# EAGLE design 5v-buck-regulator (EAGLE 6.4)
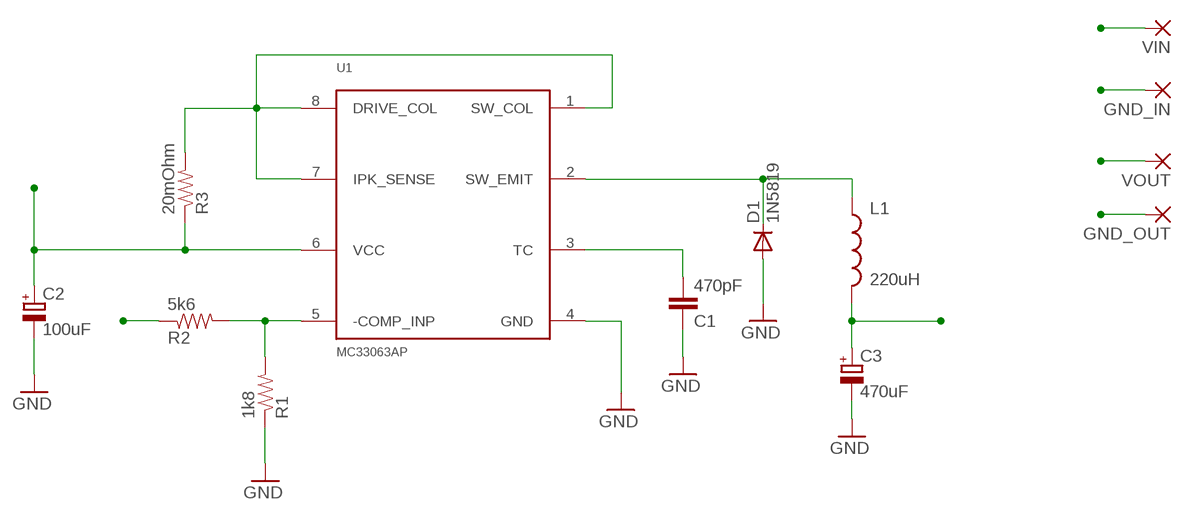
[diagram p0: schematic, sheet 1]

## Parts
C1  470pF  CAP0805  [0805]
C2  100uF  CPOL-EUC  [PANASONIC_C]
C3  470uF  CPOL-EUD  [PANASONIC_D]
D1  1N5819  MBR0520LT  [SOD123]
GND_IN  WIREPAD2,54/0,8  [2,54/0,8]
GND_OUT  WIREPAD2,54/0,8  [2,54/0,8]
L1  220uH  INDUCTOR-B82462G  [B82462G]
R1  1k8  RESISTOR0805-RES  [0805]
R2  5k6  RESISTOR0805-RES  [0805]
R3  20mOhm  RESISTOR2010  [R2010]
U1  MC33063AP  MC33063AMC34063A  [SOIC-8]
VIN  WIREPAD2,54/0,8  [2,54/0,8]
VOUT  WIREPAD2,54/0,8  [2,54/0,8]

## Nets
GND: C1.1 C2.- C3.- D1.A GND_IN.1(P) GND_OUT.1(P) R1.1 U1.4(GND)
N$2: C1.2 U1.3(TC)
N$3: R3.2 U1.1(SW_COL) U1.7(IPK_SENSE) U1.8(DRIVE_COL)
N$32: D1.C L1.P$1 U1.2(SW_EMIT)
N$55: R1.2 R2.2 U1.5(-COMP_INP)
VIN: C2.+ R3.1 U1.6(VCC) VIN.1(P)
VOUT: C3.+ L1.P$2 R2.1 VOUT.1(P)

## Library data of the parts
C1 = SparkFun:CAP: Capacitor Standard 0603 ceramic capacitor, and 0.1" leaded capacitor.
C2 C3 = rcl:CPOL-EU: POLARIZED CAPACITOR, European symbol
D1 = diode:MBR0520LT: SCHOTTKY BARRIER RECTIFIER Source: http://onsemi.com .. MBR0520LT1-D.pdf
GND_IN GND_OUT VIN VOUT = wirepad:WIREPAD: Wire PAD connect wire on PCB
L1 = SparkFun:INDUCTOR: Inductors Basic Inductor/Choke - 0603 and 1206. Footprints are not proven and vary greatly between part numbers.
R1-R3 = SparkFun:RESISTOR: Resistor Basic schematic elements and footprints for 0603, 1206, and PTH resistors.
U1 = Synapseware:MC33063A

## Board
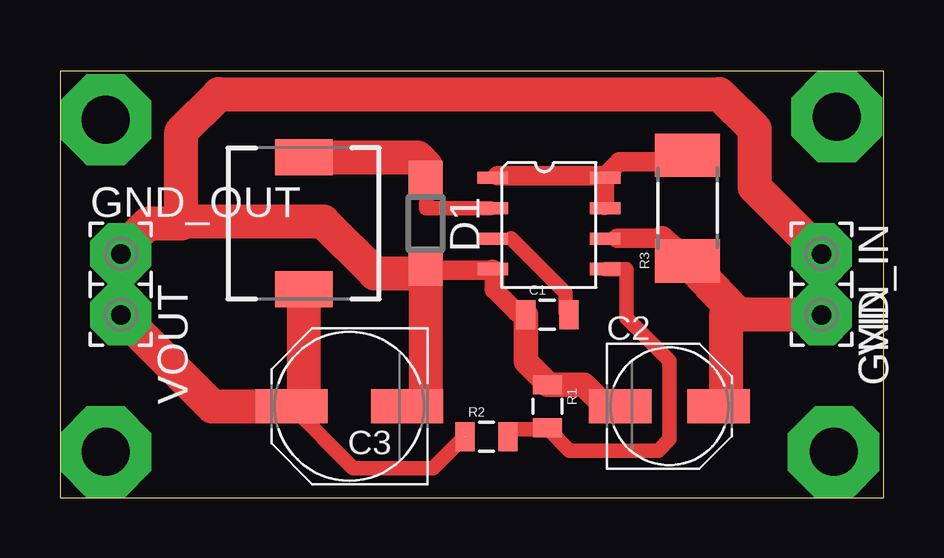
[diagram p1: board, top side]

Size 34.34 x 17.77 mm. Coordinates in mm from the lower left corner, seen from the top.
Outline: 0,0 34.34,0 34.34,17.77 0,17.77 0,0
Copper layers (1*16): Top 0.035mm / dielectric 1.5mm / Bottom 0.035mm
Design rules "default": minimum track width 16mil, minimum drill 24mil, track to track 16mil, track to pad 16mil, pad to pad 16mil, via to via 16mil, smd to smd 8mil, copper to edge 0mil, drill to drill 8mil, minimum pad ring 10mil, minimum via ring 8mil, stop-mask expansion 4mil, vias tented up to drill 0mil, thermal gap 10mil

### Footprints (pad centres in the part's own frame; a part is rotated, then mirrored left to right if it is on the bottom)
0805 = smd 0.8 x 1.2: 1 -0.9,0; 2 0.9,0
PANASONIC_C = smd 2.6 x 1.4: + 2.05,0; - -2.05,0
PANASONIC_D = smd 3 x 1.4: + 2.4,0; - -2.4,0
SOD123 = smd 1.4 x 1.4: A 1.9,0; C -1.9,0
2,54/0,8 = drill 0.813 pad 2.54 octagon: 1 0,0
B82462G = smd 2.4 x 1.5: P$1 0,2.75; P$2 0,-2.75
R2010 = smd 1.8 x 2.7: 1 -2.2,0; 2 2.2,0
SOIC-8 = smd 0.508 x 1.27: 1 -1.905,-2.286; 2 -0.635,-2.286; 3 0.635,-2.286; 4 1.905,-2.286; 5 1.905,2.413; 6 0.635,2.413; 7 -0.635,2.413; 8 -1.905,2.413

### Placement (x,y rotation side)
C1  20.32,7.62 0 top
C2  25.4,3.81 0 top
C3  12.06,3.81 180 top
D1  15.24,11.43 270 top
GND_IN  31.75,10.16 270 top
GND_OUT  2.54,10.16 0 top
L1  10.16,11.43 0 top
R1  20.32,3.81 270 top
R2  17.78,2.54 0 top
R3  26.16,12.06 90 top
U1  20.32,11.43 270 top
VIN  31.75,7.62 270 top
VOUT  2.54,7.62 270 top

### Tracks (layer width: path | path; a pad name or v marks a point on that pad's centre or on a via)
GND
  Top 0.406: 17.96,9.47 U1.4 | D1.A 15.44,9.47 15.24,9.27 | 19.46,7.32 C1.1 19.05,7.72 | 31.75,10.13 31.42,11.02 GND_IN.1 | 20.22,4.88 R1.1 20.5,4.88
  Top 0.813: 15.44,9.47 17.96,9.47 | 19.05,7.72 18.11,8.66 18.11,9.47 U1.4
  Top 1.016: 20.22,4.88 19.43,5.66 C1.1 | C2.- 22.73,3.81 21.84,4.7 20.56,4.7 R1.1
  Top 1.422: 15.24,9.27 15.24,3.81 C3.- | 31.75,10.13 28.96,12.95 28.96,15.37 27.48,16.82 6.63,16.82 5.05,15.24 5.05,11.43 | 5.05,11.43 5.31,11.51 10.97,11.51 13.13,9.35 15.06,9.35 D1.A | GND_OUT.1 2.54,10.29 3.68,11.43 5.05,11.43
N$1  (via drill 2 pad 3.81)
  other vias: 1.91,15.75
N$2
  Top 0.406: 18.8,10.82 17.98,10.82 U1.3 | 21.08,7.72 C1.2
  Top 0.61: 21.08,7.72 21.08,8.53 18.8,10.82
N$3
  Top 0.406: 18.24,13.41 U1.1 | 22.71,12.19 U1.7 | 22.71,13.41 U1.8 22.73,13.41 | 25.86,13.99 R3.2
  Top 0.813: 18.24,13.41 22.71,13.41 22.71,12.19 | 25.86,13.99 23.32,13.99 22.73,13.41
N$4  (via drill 2 pad 3.81)
  other vias: 1.91,1.91
N$5  (via drill 2 pad 3.81)
  other vias: 32.26,1.91
N$6  (via drill 2 pad 3.81)
  other vias: 32.38,15.88
N$32
  Top 0.406: 17.96,12.06 U1.2 | 15.32,13.54 D1.C 15.44,13.82 15.11,13.97
  Top 0.61: 17.96,12.06 15.27,12.06 15.32,13.54
  Top 1.422: 15.24,13.82 15.11,13.97 14.9,14.18 L1.P$1
N$55
  Top 0.406: 22.99,9.47 U1.5 | 18.67,2.85 R2.2 | 21.23,1.96 R1.2 | 20.37,2.87 R1.2 | 24.94,1.96 24.97,1.98 | 20.37,2.85 R1.2
  Top 0.61: 18.67,2.85 20.37,2.85 21.23,1.96 24.94,1.96 | U1.5 23.62,9.53 23.62,7.49 25.4,5.71 25.4,2.44 24.97,1.98
VIN
  Top 0.406: 23.24,10.82 U1.6
  Top 0.813: 25.09,10.82 23.24,10.82
  Top 1.016: 25.09,10.82 R3.1
  Top 1.422: VIN.1 28.28,7.62 | C2.+ 27.94,3.81 27.76,4.01 27.76,7.62 28.28,7.62 | 28.28,7.62 R3.1
VOUT  (1 unrouted)
  Top 0.61: 16.89,2.56 15.54,1.22 12.22,1.22 C3.+
  Top 1.422: VOUT.1 6.35,3.81 C3.+ 10.16,3.92 L1.P$2